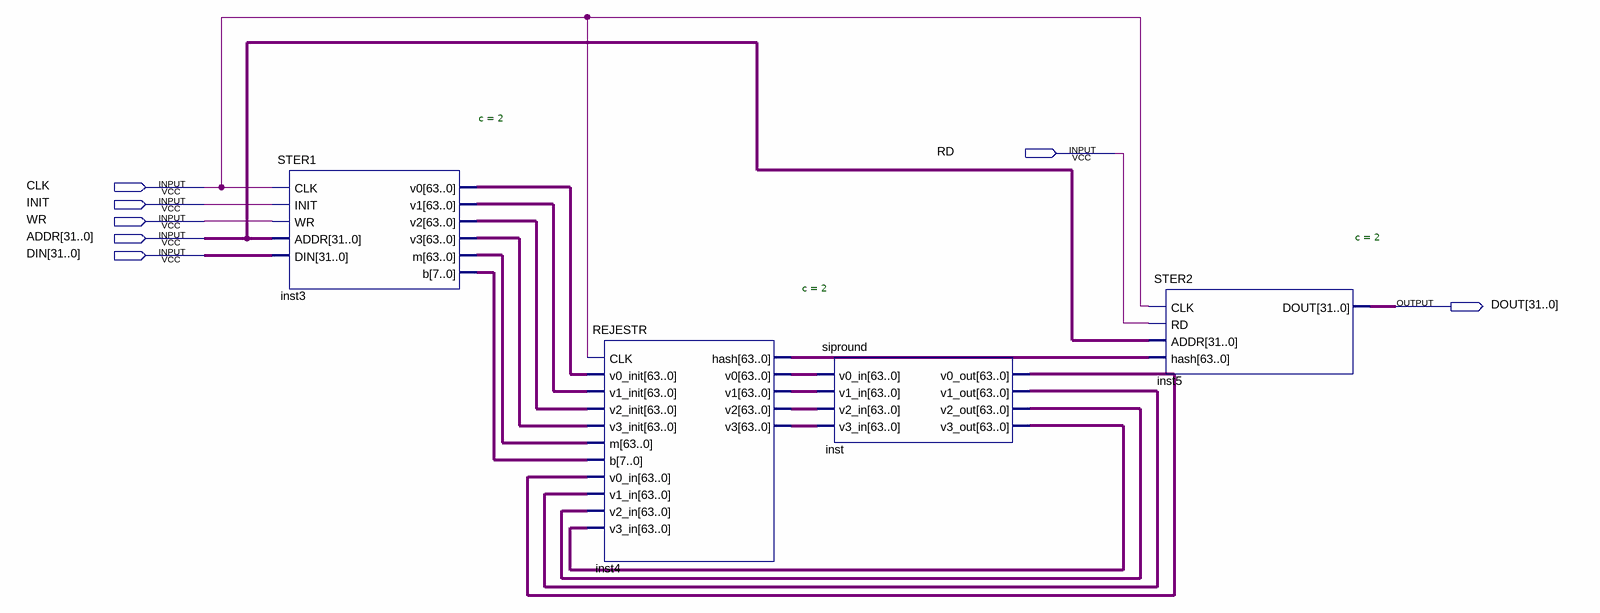
[diagram p0: schematic sheet]
// Quartus schematic Block1.bdf as structural Verilog: 4 symbols, 7 pins
module Block1 (
  input  RD,
  input  CLK,
  input  INIT,
  input  WR,
  input  [31:0] ADDR,
  input  [31:0] DIN,
  output [31:0] DOUT
);

  wire [7:0] inst3_b;
  wire [63:0] inst3_m, inst3_v0, inst3_v1, inst3_v2, inst3_v3, inst4_hash, inst4_v0, inst4_v1, inst4_v2,
       inst4_v3, inst_v0_out, inst_v1_out, inst_v2_out, inst_v3_out;

  STER1 #(.c(2)) inst3 (
    .CLK(CLK), .INIT(INIT), .WR(WR), .ADDR(ADDR), .DIN(DIN), .v0(inst3_v0), .v1(inst3_v1), .v2(inst3_v2),
    .v3(inst3_v3), .m(inst3_m), .b(inst3_b));
  REJESTR #(.c(2)) inst4 (
    .CLK(CLK), .v0_init(inst3_v0), .v1_init(inst3_v1), .v2_init(inst3_v2), .v3_init(inst3_v3), .m(inst3_m),
    .b(inst3_b), .v0_in(inst_v0_out), .v1_in(inst_v1_out), .v2_in(inst_v2_out), .v3_in(inst_v3_out),
    .hash(inst4_hash), .v0(inst4_v0), .v1(inst4_v1), .v2(inst4_v2), .v3(inst4_v3));
  sipround inst (
    .v0_in(inst4_v0), .v1_in(inst4_v1), .v2_in(inst4_v2), .v3_in(inst4_v3), .v0_out(inst_v0_out),
    .v1_out(inst_v1_out), .v2_out(inst_v2_out), .v3_out(inst_v3_out));
  STER2 #(.c(2)) inst5 (.CLK(CLK), .RD(RD), .ADDR(ADDR), .hash(inst4_hash), .DOUT(DOUT));
endmodule
